# EAGLE design Board (EAGLE 8.7.0)
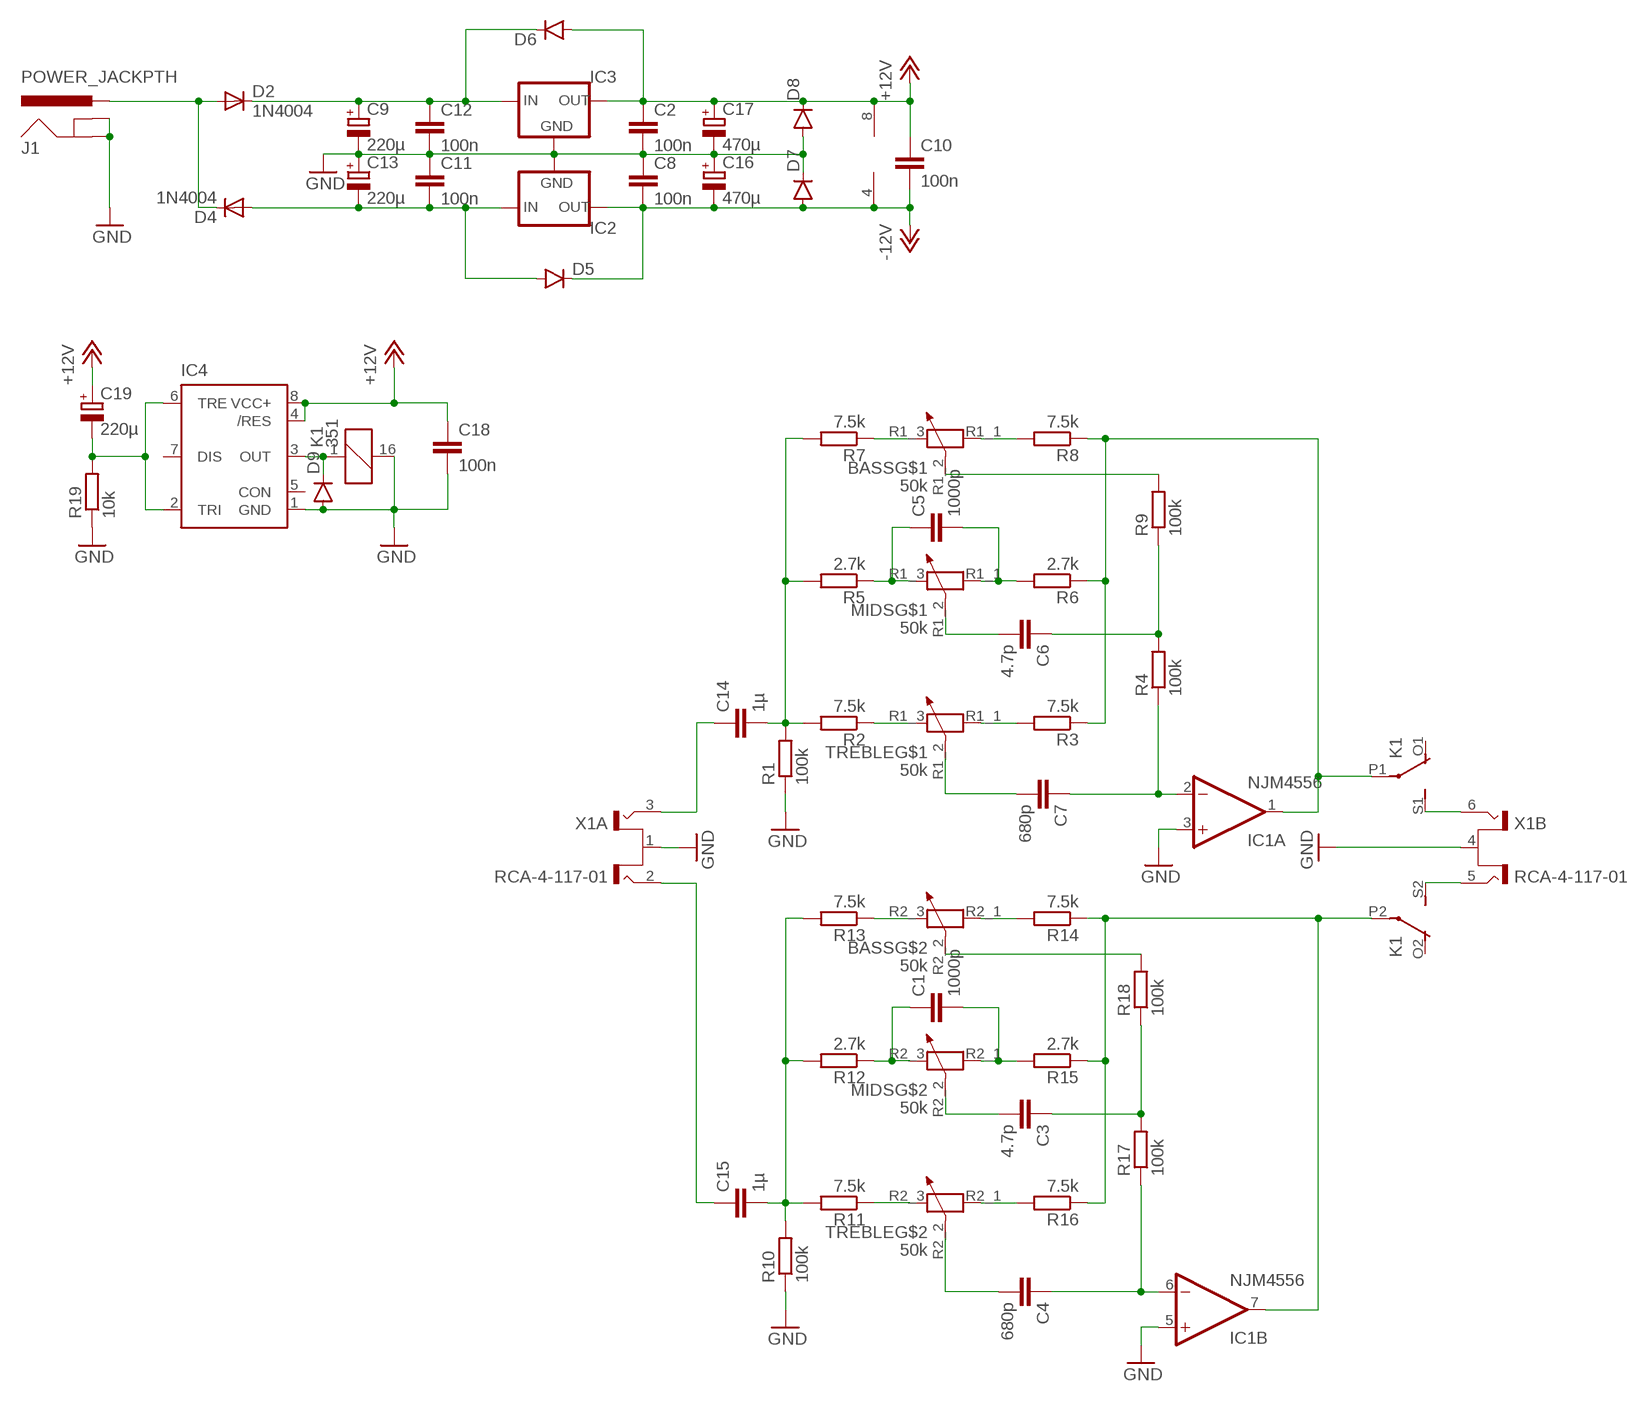
[diagram p0: schematic, sheet 1]

## Parts
BASS  50k  ALPS-RK09L12B0  [ALPS-RK09L12B0]
C1  1000p  C-EU102-054X133  [C102-054X133]
C2  100n  C-EUC0603  [C0603]
C3  4.7p  C-EU050-045X075  [C050-045X075]
C4  680p  C-EU050-045X075  [C050-045X075]
C5  1000p  C-EU102-054X133  [C102-054X133]
C6  4.7p  C-EU050-045X075  [C050-045X075]
C7  680p  C-EU050-045X075  [C050-045X075]
C8  100n  C-EUC0603  [C0603]
C9  220µ  CPOL-EU175TMP-0810  [175TMP-0810]
C10  100n  C-EUC0603  [C0603]
C11  100n  C-EUC0603  [C0603]
C12  100n  C-EUC0603  [C0603]
C13  220µ  CPOL-EU175TMP-0810  [175TMP-0810]
C14  1µ  C-EU050-045X075  [C050-045X075]
C15  1µ  C-EU050-045X075  [C050-045X075]
C16  470µ  CPOL-EU175TMP-0810  [175TMP-0810]
C17  470µ  CPOL-EU175TMP-0810  [175TMP-0810]
C18  100n  C-EUC0603  [C0603]
C19  220µ  CPOL-EU175TMP-0810  [175TMP-0810]
D2  1N4004  [DO41-10]
D4  1N4004  [DO41-10]
D5  DIODEBAS16  [SOD-323]
D6  DIODEBAS16  [SOD-323]
D7  DIODEBAS16  [SOD-323]
D8  DIODEBAS16  [SOD-323]
D9  DIODEBAS16  [SOD-323]
IC1  NJM4556  LM358N  [DIL08]
IC2  79XXS  [79XXS]
IC3  78XXS  [78XXS]
IC4  NE555D  [SO08]
J1  POWER_JACKPTH  [POWER_JACK_PTH]
K1  351  [351]
MIDS  50k  ALPS-RK09L12B0  [ALPS-RK09L12B0]
R1  100k  R-EU_R1206  [R1206]
R2  7.5k  R-EU_R1206  [R1206]
R3  7.5k  R-EU_R1206  [R1206]
R4  100k  R-EU_R1206  [R1206]
R5  2.7k  R-EU_R1206  [R1206]
R6  2.7k  R-EU_R1206  [R1206]
R7  7.5k  R-EU_R1206  [R1206]
R8  7.5k  R-EU_R1206  [R1206]
R9  100k  R-EU_R1206  [R1206]
R10  100k  R-EU_R1206  [R1206]
R11  7.5k  R-EU_R1206  [R1206]
R12  2.7k  R-EU_R1206  [R1206]
R13  7.5k  R-EU_R1206  [R1206]
R14  7.5k  R-EU_R1206  [R1206]
R15  2.7k  R-EU_R1206  [R1206]
R16  7.5k  R-EU_R1206  [R1206]
R17  100k  R-EU_R1206  [R1206]
R18  100k  R-EU_R1206  [R1206]
R19  10k  R-EU_R1206  [R1206]
TREBLE  50k  ALPS-RK09L12B0  [ALPS-RK09L12B0]
X1  RCA-4-117-01  [RCA-4-117-01]

## Nets
+12V: C2.1 C10.1 C17.+ C18.1 C19.+ D6.A D8.C IC1.8(P:V+) IC3.OUT IC4.4(/RES) IC4.8(VCC+)
-12V: C8.2 C10.2 C16.- D5.C D7.A IC1.4(P:V-) IC2.OUT
GND: C2.2 C8.1 C9.- C11.1 C12.2 C13.+ C16.+ C17.- C18.2 D7.C D8.A D9.A IC1.3(A:+IN) IC1.5(B:+IN) IC2.GND IC3.GND IC4.1(GND) J1.GND J1.GNDBREAK K1.16 R1.1 R10.1 R19.1 X1.1(A:S) X1.4(B:S)
IN_L: C15.1 X1.2(A:T1)
IN_R: C14.1 X1.3(A:T2)
N$1: C14.2 R1.2 R2.2 R5.2 R7.2
N$2: R2.1 TREBLE.R1_3
N$3: C7.2 TREBLE.R1_2
N$4: R3.2 TREBLE.R1_1
N$5: C5.1 MIDS.R1_3 R5.1
N$6: C15.2 R10.2 R11.2 R12.2 R13.2
N$7: BASS.R1_3 R7.1
N$8: BASS.R1_1 R8.2
N$9: D2.A D4.C J1.PWR
N$10: BASS.R2_3 R13.1
N$11: C6.2 MIDS.R1_2
N$12: C6.1 R4.2 R9.1
N$13: K1.S1(2:S) X1.6(B:T2)
N$14: BASS.R1_2 R9.2
N$15: C5.2 MIDS.R1_1 R6.2
N$16: C4.2 TREBLE.R2_2
N$17: C3.2 MIDS.R2_2
N$18: BASS.R2_1 R14.2
N$19: C1.1 MIDS.R2_3 R12.1
N$20: C1.2 MIDS.R2_1 R15.2
N$21: R11.1 TREBLE.R2_3
N$22: R16.2 TREBLE.R2_1
N$23: C11.2 C13.- D4.A D5.A IC2.IN
N$24: C9.+ C12.1 D2.C D6.C IC3.IN
N$25: K1.S2(3:S) X1.5(B:T1)
N$26: C19.- IC4.2(TRI) IC4.6(TRE) R19.2
N$28: BASS.R2_2 R18.2
N$29: C3.1 R17.2 R18.1
N$30: D9.C IC4.3(OUT) K1.1
OUT_L: IC1.7(B:OUT) K1.P2(3:P) R14.1 R15.1 R16.1
OUT_L_DAMPED: C4.1 IC1.6(B:-IN) R17.1
OUT_R: IC1.1(A:OUT) K1.P1(2:P) R3.1 R6.1 R8.1
OUT_R_DAMPED: C7.1 IC1.2(A:-IN) R4.1
Unconnected: IC4.5(CON) IC4.7(DIS) K1.O1(2:O) K1.O2(3:O)

## Library data of the parts
BASS MIDS TREBLE = OwnStuff:ALPS-RK09L12B0
C1-C8 C10-C12 C14 C15 C18 = rcl:C-EU: CAPACITOR, European symbol; SPICEPREFIX: C
C9 C13 C16 C17 C19 = rcl:CPOL-EU: POLARIZED CAPACITOR, European symbol; SPICEPREFIX: C
D2 D4 = diode:1N4004: DIODE general purpose rectifier, 1 A
D5-D9 = SparkFun-DiscreteSemi:DIODE: Diode These are standard reverse protection diodes and small signal diodes. SMA package can handle up to about 1A. SOD-323 can handle about 200mA. What the SOD-323 package when ordering, there are some mfgs out there that are 5-pin packages.; PROD_ID: DIO-09646; VALUE: 250mA/100V
IC1 = linear:LM358: OP AMP also LM158; LM258; LM2904 Source: http://cache.national.com/ds/LM/LM158.pdf
IC2 = v-reg:79XXS: VOLTAGE REGULATOR
IC3 = v-reg:78XXS: VOLTAGE REGULATOR
IC4 = SparkFun-AnalogIC:NE555: General purpose bipolar Timer
J1 = SparkFun-Connectors:POWER_JACK: Power Jack This is the standard 5.5mm barrel jack for power. The PTH is the most common, proven, reliable, footprint. The Slot footprint only works if the mill layer is transmitted to the PCB fab house so be warned. Mating wall wart : TOL-00298 (and others); PROD_ID: CONN-08197
K1 = relay:351: RELAY 2 x switch, Omron; OC_FARNELL: unknown; OC_NEWARK: unknown
R1-R19 = rcl:R-EU_: RESISTOR, European symbol; SPICEPREFIX: R
X1 = con-conrad:RCA-4-117-01: Cinch-Anschlussplatte 72385 Gold, Rot, Weiß BKL Electronic Conrad Bestellnummer : 736910 - 62 Source: Data sheet <http://www.produktinfo.conrad.com/datenblaetter/725000-749999/736910-da-01-en-Cinch_Anschlussplatte_4polig.pdf>; SPICEPREFIX: M

## Board
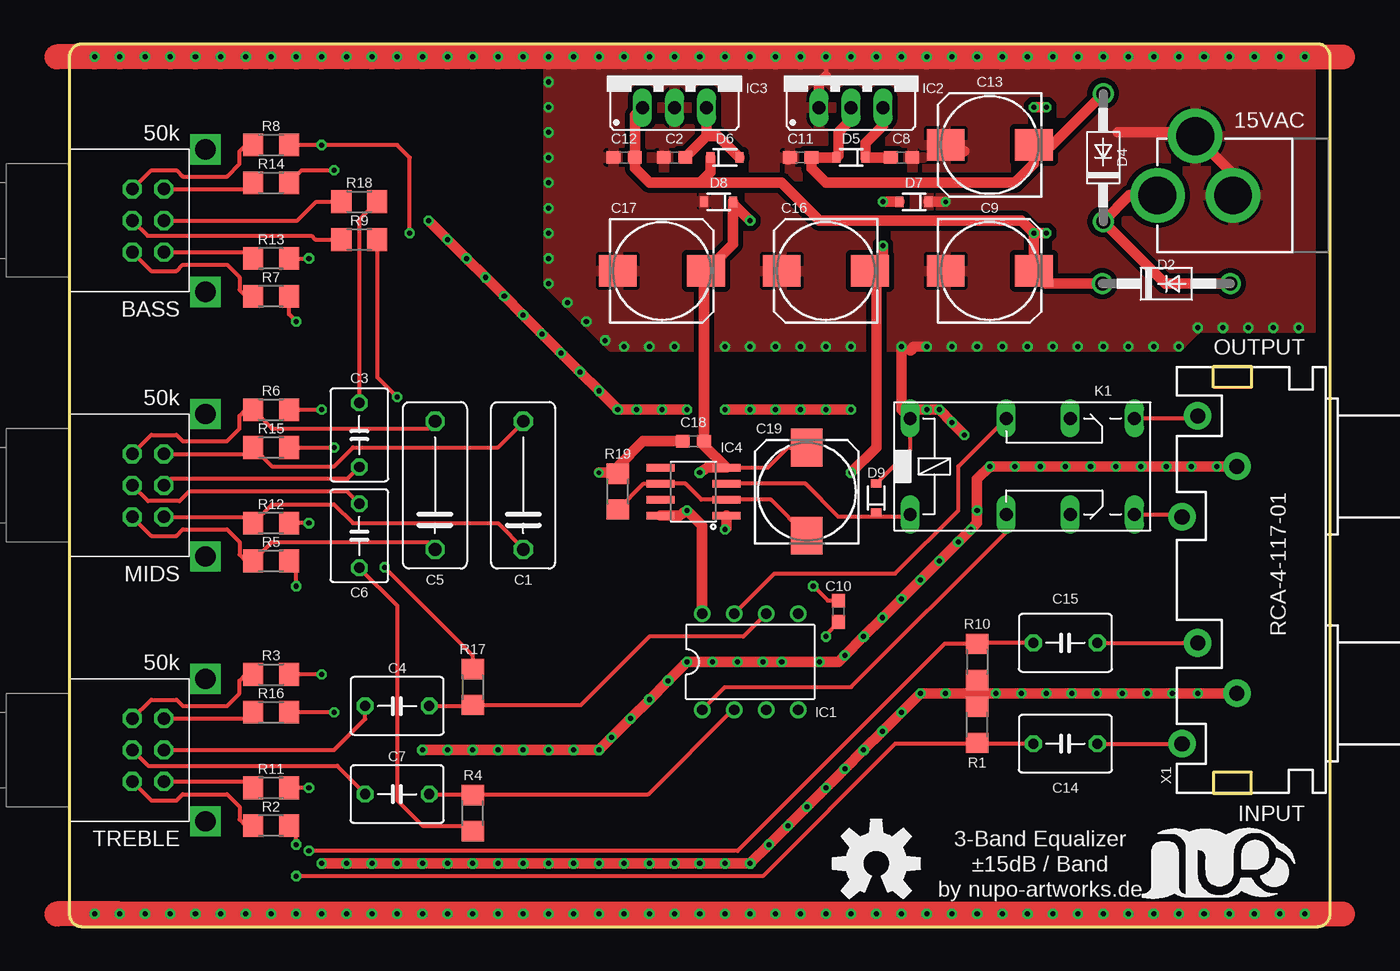
[diagram p1: board, top side]
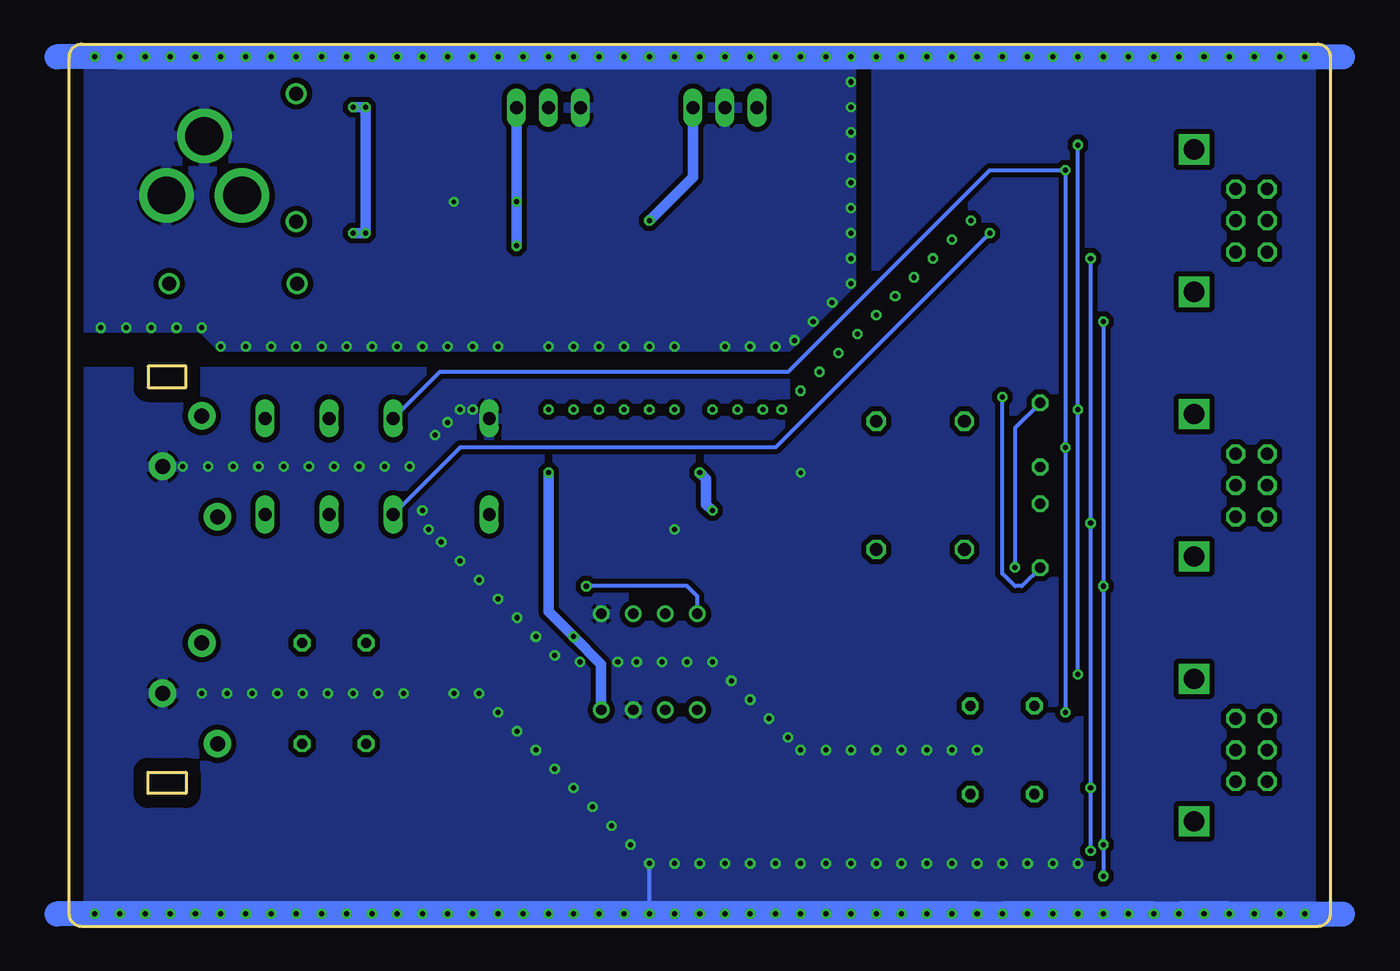
[diagram p2: board, bottom side, seen from below]

Size 100 x 70 mm. Coordinates in mm from the lower left corner, seen from the top.
Outline: 0,1 arc90 1,0 99,0 arc90 100,1 100,69 arc90 99,70 1,70 arc90 0,69 0,1
Outline: 93.75,10.55 93.75,12.25 90.75,12.25 90.75,10.55 93.75,10.55
Outline: 90.75,44.45 93.75,44.45 93.75,42.77 90.75,42.77 90.75,44.45
Copper layers (1*16): Top 0.035mm / dielectric 1.5mm / Bottom 0.035mm
Design rules "default *": minimum track width 6mil, minimum drill 0.35mm, track to track 6mil, track to pad 6mil, pad to pad 6mil, via to via 6mil, smd to smd 6mil, copper to edge 40mil, drill to drill 6mil, minimum pad ring 10mil, minimum via ring 8mil, stop-mask expansion 4mil, vias tented up to drill 20mil, thermal gap 10mil
tKeepout: 25 lines
bKeepout: 2 lines

### Footprints (pad centres in the part's own frame; a part is rotated, then mirrored left to right if it is on the bottom)
ALPS-RK09L12B0 = drill 1 octagon: R1_1 2.5,-2.5; R1_2 2.5,0; R1_3 2.5,2.5; R2_1 0,-2.5; R2_2 0,0; R2_3 0,2.5 | drill 1.6 square: S1 -3.3,5.65; S2 -3.3,-5.65
C102-054X133 = drill 1.016 octagon: 1 -5.08,0; 2 5.08,0
C0603 = smd 1.1 x 1: 1 -0.85,0; 2 0.85,0
C050-045X075 = drill 0.813 octagon: 1 -2.54,0; 2 2.54,0
175TMP-0810 = smd 3 x 2.5: + 3.5,0; - -3.5,0
DO41-10 = drill 1.118: A 5.08,0; C -5.08,0
SOD-323 = smd 0.63 x 0.83: A 1.15,0; C -1.15,0
DIL08 = drill 0.813 pad 1.27: 1 -3.81,-3.81; 2 -1.27,-3.81; 3 1.27,-3.81; 4 3.81,-3.81; 5 3.81,3.81; 6 1.27,3.81; 7 -1.27,3.81; 8 -3.81,3.81
79XXS = drill 1.016 long: GND -2.54,-2.54; IN 0,-2.54; OUT 2.54,-2.54
78XXS = drill 1.016 long: GND 0,-2.54; IN -2.54,-2.54; OUT 2.54,-2.54
SO08 = smd 0.61 x 2.21: 1 -1.905,-2.616; 2 -0.635,-2.616; 3 0.635,-2.616; 4 1.905,-2.616; 5 1.905,2.616; 6 0.635,2.616; 7 -0.635,2.616; 8 -1.905,2.616
POWER_JACK_PTH = drill 2.997 pad 4.318: GND 0,7.7; GNDBREAK 4.7,10.7; PWR 0,13.7
351 = drill 1.016 long: 1 -3.81,-3.81; 16 -3.81,3.81; O1 8.89,-3.81; O2 8.89,3.81; P1 3.81,-3.81; P2 3.81,3.81; S1 13.97,-3.81; S2 13.97,3.81
R1206 = smd 1.6 x 1.803: 1 -1.422,0; 2 1.422,0
RCA-4-117-01 = drill 1.2 pad 2.184: 1 9,3.1; 2 5,0; 3 13,-1.25; 4 -9,3.1; 5 -13,0; 6 -5,-1.25

### Placement (x,y rotation side)
BASS  7.5,56 180 top
C1  36,35 90 top
C2  48,61 180 top
C3  23,39 270 top
C4  26,17.5 180 top
C5  29,35 90 top
C6  23,31 90 top
C7  26,10.5 180 top
C8  66,61 180 top
C9  73,52 0 top
C10  61,25 270 top
C11  58,61 0 top
C12  44,61 180 top
C13  73,62 180 top
C14  79,14.5 180 top
C15  79,22.5 180 top
C16  60,52 180 top
C17  47,52 0 top
C18  49.5,38.5 180 top
C19  58.5,34.5 90 top
D2  87,51 0 top
D4  82,61 90 top
D5  62,61 180 top
D6  52,61 0 top
D7  67,57.5 180 top
D8  51.5,57.5 180 top
D9  64,34 90 top
IC1  54,21 0 top
IC2  62,67.5 0 top
IC3  48,67.5 0 top
IC4  49.5,34.5 90 top
J1  100,58 90 top
K1  70.5,36.5 0 top
MIDS  7.5,35 180 top
R1  72,16 270 top
R2  16,8 0 top
R3  16,20 180 top
R4  32,9 270 top
R5  16,29 0 top
R6  16,41 180 top
R7  16,50 0 top
R8  16,62 180 top
R9  23,54.5 180 top
R10  72,21 90 top
R11  16,11 0 top
R12  16,32 0 top
R13  16,53 0 top
R14  16,59 180 top
R15  16,38 180 top
R16  16,17 180 top
R17  32,19 90 top
R18  23,57.5 180 top
R19  43.5,34.5 270 top
TREBLE  7.5,14 180 top
U$1  [LOGO-SILKSCREEN]  91,4 0 top
U$2  [OSHW-LOGO-L]  64,5 0 top
X1  89.5,27.5 270 top

### Tracks (layer width: path | path; a pad name or v marks a point on that pad's centre or on a via)
+12V  (via drill 0.4)
  Top 0.305: C19.+ 57,38 55.41,36.41 IC4.4 | v59,27 60.15,25.85 C10.1
  Top 0.813: C2.1 50.54,62.69 | 50.54,62.69 IC3.OUT | D6.A 51.46,62.69 50.54,62.69 | C17.+ 52.65,54.15 D8.C 52.65,57.35 v54,56 | 50,51.5 C17.+ | v50,36 50.59,36.41 IC4.4 50.35,38.17 C18.1 50.35,51.85 C17.+ | IC4.8 48.41,32.59 v49,33 | 48.69,32.81 v49,33 | IC1.8 50.19,31.81 v49,33
  Bottom 0.305: IC1.8 50.19,26.19 51,27 v59,27
  Bottom 0.813: IC3.OUT 50.54,59.46 v54,56 | v50,36 49.5,35.5 49.5,33.5 v49,33
-12V  (via drill 0.4)
  Top 0.305: C10.2 60,23.15 v60,23
  Top 0.813: IC2.OUT 64.54,63.54 63.15,62.15 D5.C C8.2 | D7.A v64.54,57.5 | v64.54,54 64.54,53.04 C16.- 64,51.5 64,38 v62,36
  Bottom 0.813: IC2.OUT v64.54,57.5 v64.54,54 | v62,36 62,25 v60,23 57.81,20.81 IC1.4
GND  (via drill 0.35, 0.4)
  Top 0.305: R10.1 72,18.5 | v60,69 60,67.44 | D9.A 66.69,37.84 K1.16
  Top 0.813: C13.+ 71,61.5 | 57,60.85 C11.1 57,61.15 | C2.2 47,61.15 | IC2.GND 59.46,66.9 60,67.44 | X1.1 v89.5,18.5 v87.5,18.5 v85.5,18.5 v83.5,18.5 v81.5,18.5 v79.5,18.5 v77.5,18.5 v75.5,18.5 v73.5,18.5 72,18.5 | 72,18.5 71.5,18.5 | 71.5,18.5 v69.5,18.5 v67.5,18.5 v66,17 v64.5,15.5 v63,14 v61.5,12.5 v60,11 v58.5,9.5 v57,8 v55.5,6.5 v54,5 v52,5 v50,5 v48,5 v46,5 v44,5 v42,5 v40,5 v38,5 v36,5 v34,5 v32,5 v30,5 v28,5 v26,5 v24,5 v22,5 v20,5 | R10.1 71.5,19.08 71.5,18.5 | R1.1 72,18.5 | v28,14 v30,14 v32,14 v34,14 v36,14 v38,14 v40,14 v42,14 v43,15 v44.5,16.5 v46,18 v47.5,19.5 v49,21 v51,21 v53,21 v55,21 v56.5,21 v59.5,21 61,21 v61.5,21.5 v63,23 v64.5,24.5 v66,26 v67.5,27.5 v69,29 v70.5,30.5 v71.5,31.5 72,32 v72,33 72,35.5 v73,36.5 v75,36.5 v77,36.5 v79,36.5 v81,36.5 v83,36.5 v85,36.5 v87,36.5 v89,36.5 v91,36.5 X1.4 | J1.GND 92.3,59.7 J1.GNDBREAK 89,63 83.15,63 | D7.C v69.5,57.5 | 66.69,45.69 67,46 v68,46 | v52,31.5 52.12,31.62 IC4.1 | K1.16 66,41 | 66,41 v66,46 | v71,39 v70,40 v69,41 v68,41 66,41 | v42,36 43.42,36 R19.1 43.5,36.5 45.5,38.5 C18.2
  Top 2: -1,69 v2,69 v4,69 v6,69 v8,69 v10,69 v12,69 v14,69 v16,69 v18,69 v20,69 v22,69 v24,69 v26,69 v28,69 v30,69 v32,69 v34,69 v36,69 v38,69 v40,69 v42,69 v44,69 v46,69 v48,69 v50,69 v52,69 v54,69 v56,69 v58,69 v60,69 v62,69 v64,69 v66,69 v68,69 v70,69 v72,69 v74,69 v76,69 v78,69 v80,69 v82,69 v84,69 v86,69 v88,69 v90,69 v92,69 v94,69 v96,69 v98,69 101,69 | -1,1 v2,1 v4,1 v6,1 v68,1 v96,1 v98,1 101,1
  Bottom 0.305: v54,1 v54,5
  Bottom 2: v30,1 v26,1 v24,1 v22,1 v20,1 v18,1 v16,1 | v16,1 v12,1 v10,1 | v10,1 v4,1 -1,1 | v8,1 v10,1 | v14,1 v16,1 | v28,1 v30,1 | v30,1 v32,1 v34,1 v36,1 v38,1 v40,1 v42,1 v44,1 v46,1 v48,1 v50,1 v52,1 v54,1 v56,1 v58,1 v60,1 v62,1 v64,1 v66,1 v68,1 v70,1 v72,1 v74,1 v76,1 v78,1 v80,1 v82,1 v84,1 v86,1 v88,1 v90,1 v92,1 v94,1 v96,1 101,1 | -1,69 v4,69 v96,69 101,69
  other vias: 97.5,47.5 95.5,47.5 93.5,47.5 91.5,47.5 89.5,47.5 88,46 86,46 84,46 82,46 80,46 78,46 76,46 74,46 72,46 70,46 62,46 60,46 58,46 56,46 54,46 52,46 48,46 46,46 44,46 42.5,46.5 41,48 39.5,49.5 38,51 38,53 38,55 38,57 38,59 38,61 38,63 38,65 38,67
  pour Bottom (isolate 0.406): 38,70 38,51 43,46 88,46 89.5,47.5 100,47.5 100,70
  pour Top (isolate 0.406): 38,70 38,51 43,46 88,46 89.5,47.5 100,47.5 100,70
  pour Bottom (isolate 0.406): 36,70 36,50 42,44 100,44 100,0 0,0 0,70
IN_L
  Top 0.305: C15.1 X1.2
IN_R
  Top 0.305: C14.1 X1.3
N$1  (via drill 0.4)
  Top 0.305: R1.2 72.08,14.5 | 72.08,14.5 65.5,14.5 55,4 v18,4 | C14.2 72.08,14.5 | v18,48 17.42,48.58 R7.2 | 17.42,28.92 R5.2 18,28.42 v18,27 | v18,6.5 18,7.42 R2.2
  Bottom 0.305: v18,48 v18,27 v18,6.5 v18,4
N$2
  Top 0.305: TREBLE.R1_3 6.5,10 8.5,10 9,10.5 12.5,10.5 13.5,9.5 13.5,8.5 14,8 R2.1
N$3
  Top 0.305: C7.2 23.46,10.54 21.25,12.75 6.25,12.75 TREBLE.R1_2
N$4
  Top 0.305: TREBLE.R1_1 6.5,18 8.5,18 9,17.5 12.5,17.5 13.5,18.5 13.5,19.5 14,20 R3.2
N$5
  Top 0.305: MIDS.R1_3 6.5,31 8.5,31 9,31.5 12.5,31.5 13.5,30.5 13.5,29.5 14,29 R5.1 16,30.42 16,30.5 28.42,30.5 C5.1
N$6  (via drill 0.4)
  Top 0.305: R13.2 v19,53 | v19,6 53,6 69.42,22.42 R10.2 72.08,22.5 C15.2 | v19,32 R12.2 | v19,11 R11.2
  Bottom 0.305: v19,53 v19,32 v19,11 v19,6
N$7
  Top 0.305: BASS.R1_3 6.5,52 8.5,52 9,52.5 12.5,52.5 13.5,51.5 13.5,50.5 14,50 R7.1
N$8
  Top 0.305: BASS.R1_1 6.5,60 8.5,60 9,59.5 12.5,59.5 13.5,60.5 13.5,61.5 14,62 R8.2
N$9
  Top 0.813: J1.PWR 84.08,58 D4.C 86.92,51 D2.A
N$10
  Top 0.305: BASS.R2_3 14.08,53.5 R13.1
N$11
  Top 0.305: 22.75,33.75 23,33.5 C6.2 22.04,34.5 9.5,34.5 8.75,33.75 6.25,33.75 MIDS.R1_2
N$12  (via drill 0.4)
  Top 0.305: R9.1 24.42,43.58 v26,42 | C6.1 26,25.46 26,10 28,8 32,8 R4.2
  Bottom 0.305: v26,42 26,28 25,27 24.46,27 C6.1
N$13
  Top 0.305: K1.S1 88.06,32.69 X1.6
N$14
  Top 0.305: BASS.R1_2 6.21,54.79 19.21,54.79 19.5,54.5 R9.2
N$15
  Top 0.305: MIDS.R1_1 6.5,39 8.5,39 9,38.5 12.5,38.5 13.5,39.5 13.5,40.5 14,41 R6.2 16.08,39.5 28.42,39.5 C5.2
N$16
  Top 0.305: C4.2 23.46,16.46 21,14 TREBLE.R2_2
N$17
  Top 0.305: C3.2 22.04,35.5 8,35.5 MIDS.R2_2
N$18
  Top 0.305: BASS.R2_1 14.08,58.5 R14.2
N$19
  Top 0.305: MIDS.R2_3 14.08,32.5 R12.1 16.08,33.5 21,33.5 22.5,32 34,32 36,30 C1.1
N$20
  Top 0.305: MIDS.R2_1 14.08,37.5 R15.2 16.08,36.5 21,36.5 22.5,38 34,38 36,40 C1.2
N$21
  Top 0.305: TREBLE.R2_3 14.08,11.5 R11.1
N$22
  Top 0.305: TREBLE.R2_1 14.08,16.5 R16.2
N$23
  Top 0.813: IC2.IN 62,64 61,63 61,61.15 D5.A C11.2 58.85,60.15 60,59 75,59 76.5,60.5 C13.- 77.92,62 D4.A
N$24  (via drill 0.4)
  Top 0.813: v77.5,55 v76.5,55 | v76.5,55 C9.+ 77.5,51 D2.C | v77.5,65 v76.5,65 | D6.C 50.85,59.85 50,59 | 50,59 46,59 44.85,60.15 C12.1 44.85,64.35 IC3.IN | v76.5,55 75.5,56 59.5,56 56.5,59 50,59
  Bottom 0.813: v77.5,65 v76.5,65 v76.5,55 v77.5,55
N$25
  Top 0.305: X1.5 89.31,40.31 K1.S2
N$26
  Top 0.305: R19.2 45.56,35.13 IC4.6 48.87,35.13 50.13,33.87 IC4.2 55.63,33.87 C19.-
N$27  (via drill 0.4)
  Top 0.813: v62,41 v60,41 v58,41 v56,41 v54,41 v52,41
N$28
  Top 0.305: BASS.R2_2 18.08,56 19.58,57.5 R18.2
N$29  (via drill 0.4)
  Top 0.305: R18.1 23,56.08 C3.1 | v25,28.5 32,21.5 R17.2
  Bottom 0.305: C3.1 25,39.54 v25,28.5
N$30
  Top 0.305: K1.1 66,32.5 64,32.5 | 64,32.5 61,32.5 58.37,35.13 IC4.3 | D9.C 64,32.5
N$31  (via drill 0.4)
  Top 0.813: v49,41 v47,41 v45,41 v43.5,41 v42,42.5 v40.5,44 v39,45.5 v37.5,47 v36,48.5 v34.5,50 v33,51.5 v31.5,53 v30,54.5 29,55.5 v28.5,56
OUT_L  (via drill 0.4)
  Top 0.305: IC1.7 55.92,28 65.5,28 70.5,33 70.5,36.5 K1.P2 | R14.1 18.42,60 v21,60 | R15.1 v21,38 | v21,17 R16.1
  Bottom 0.305: v21,17 v21,38 v21,60 27,60 43,44 70.62,44 K1.P2
OUT_L_DAMPED
  Top 0.305: C4.1 31.92,17.5 R17.1 40.58,17.58 46,23 53.46,23 IC1.6
OUT_R  (via drill 0.4)
  Top 0.305: IC1.1 52,19 62,19 74.31,31.31 K1.P1 | v27,55 27,61 26,62 v20,62 R8.1 | R6.1 v20,41 | v20,20 R3.1
  Bottom 0.305: v20,20 v20,41 v20,62 | v27,55 44,38 69,38 K1.P1
OUT_R_DAMPED
  Top 0.305: C7.1 31.92,10.5 R4.1 32.08,10.5 45.92,10.5 52.73,17.31 IC1.2

### Text on the board
tPlace: 15VAC | OUTPUT | INPUT | 3-Band Equalizer | ±15dB / Band | by nupo-artworks.de